# Altium schematic sheet Memory Chips 5 to 8.SchDoc
size A3
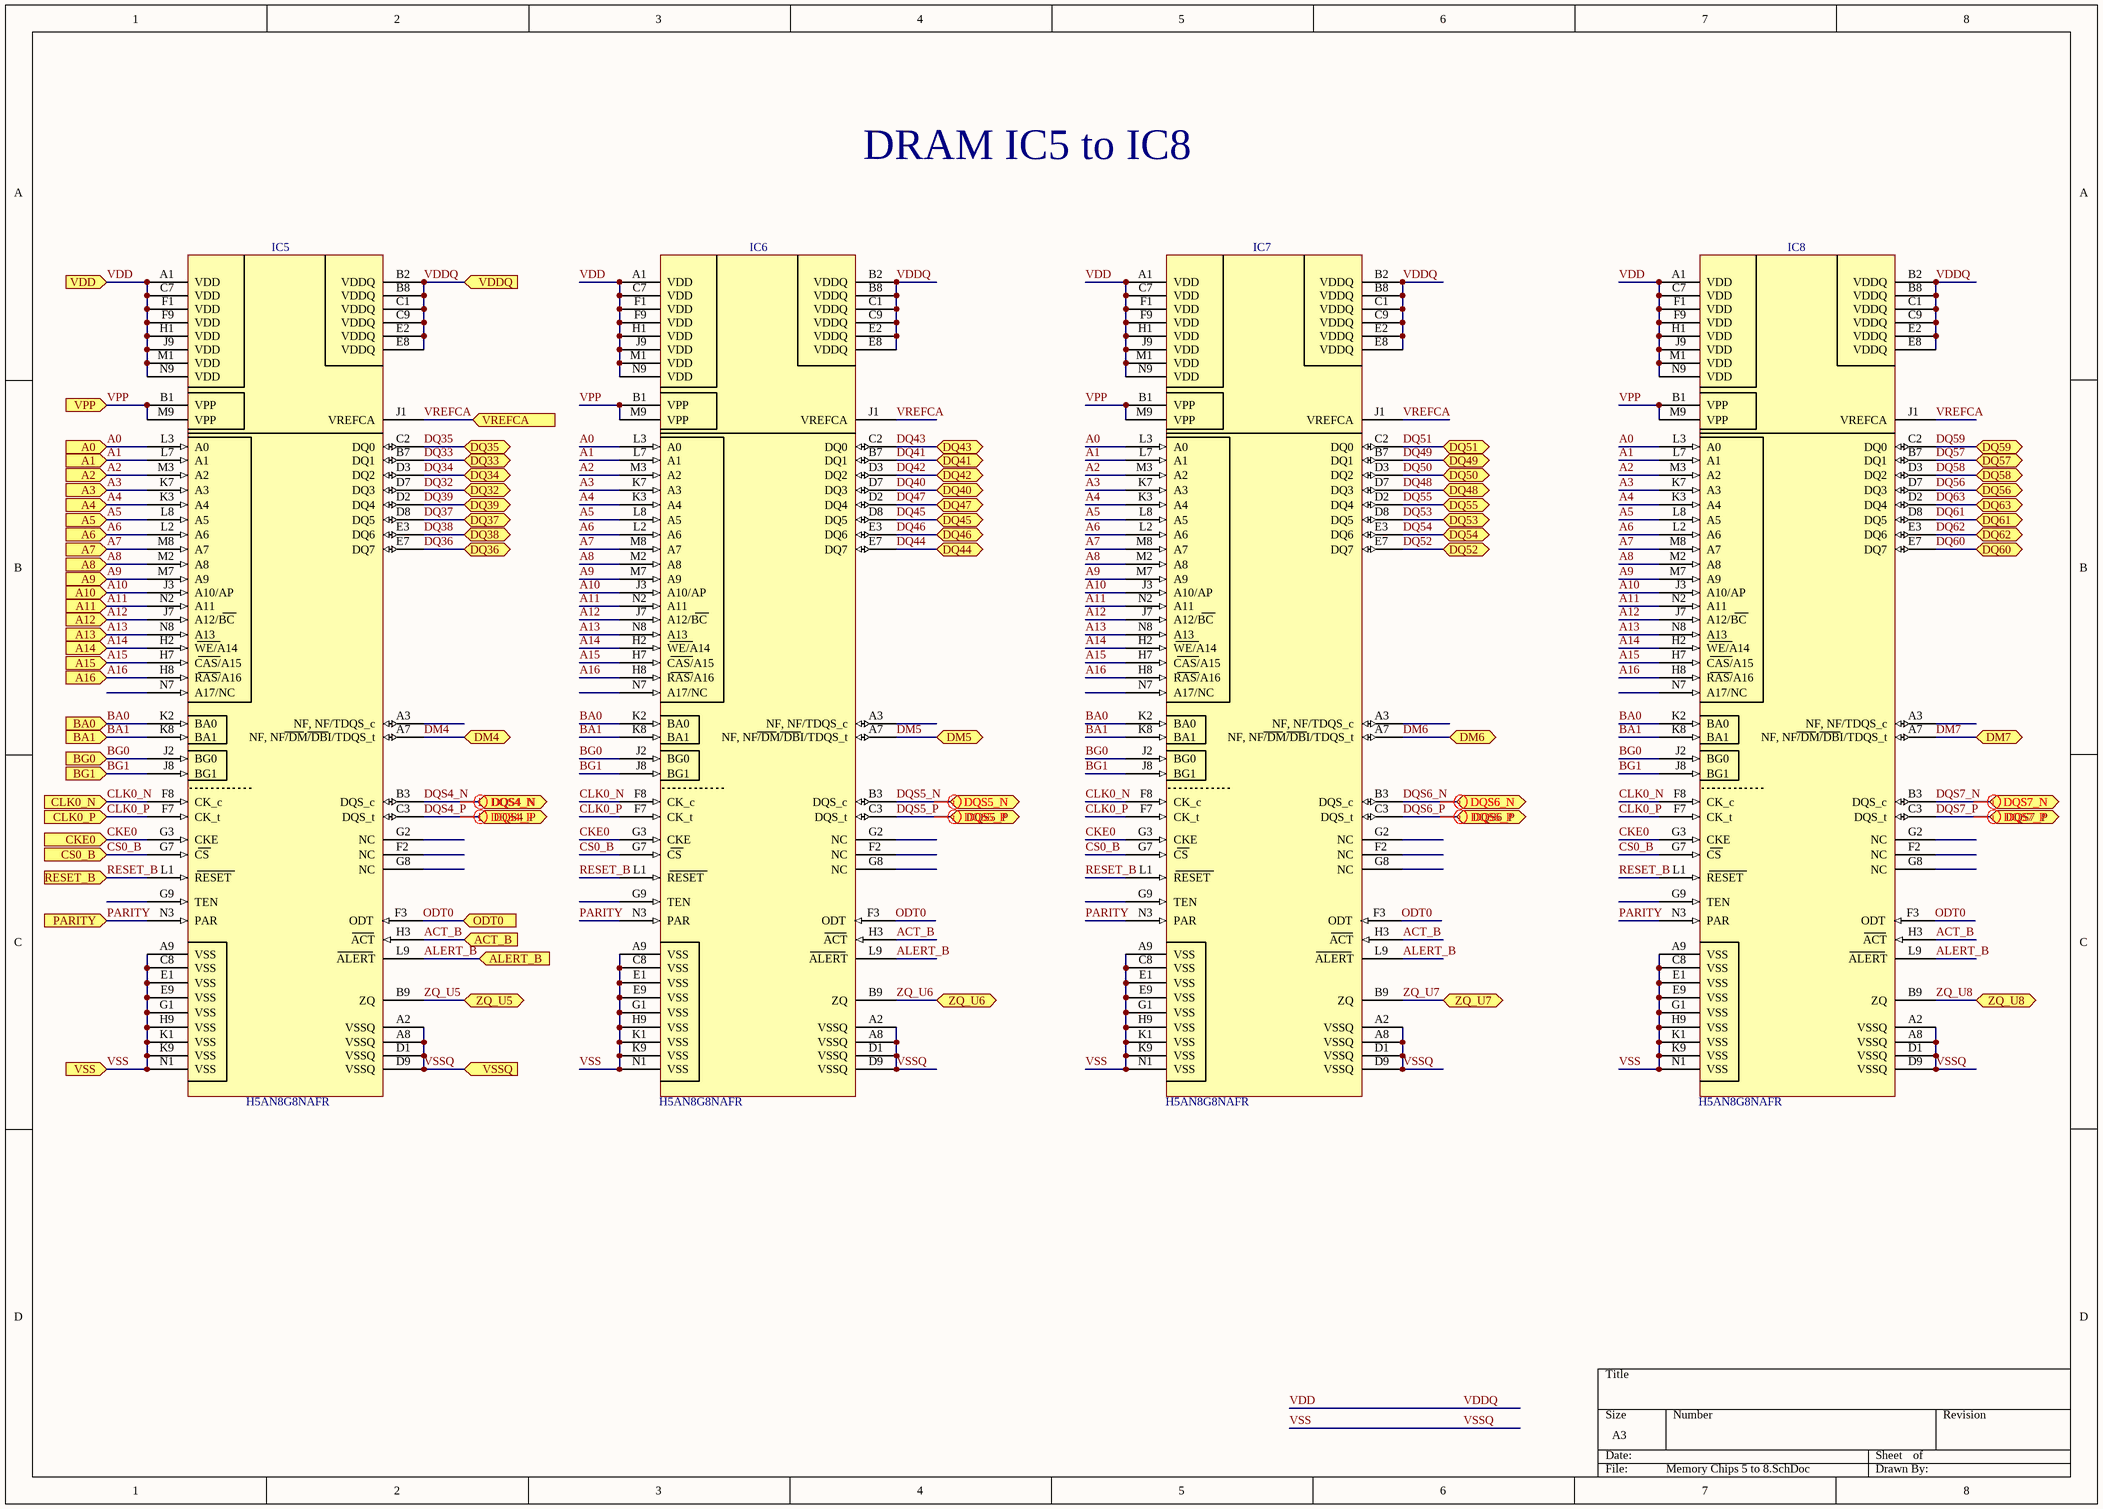
[diagram p0: Memory Chips 5 to 8.SchDoc]

## Parts
IC5  H5AN8G8NAFR  [H5AN8G8NAFR]
IC6  H5AN8G8NAFR  [H5AN8G8NAFR]
IC7  H5AN8G8NAFR  [H5AN8G8NAFR]
IC8  H5AN8G8NAFR  [H5AN8G8NAFR]

## Ports
A0 (in), A1 (in), A2 (in), A3 (in), A4 (in), A5 (in), A6 (in), A7 (in), A8 (in), A9 (in), A10 (in), A11 (in), A12 (in), A13 (in), A14 (in), A15 (in), A16 (in), ACT_B (in), ALERT_B (in), BA0 (in), BA1 (in), BG0 (in), BG1 (in), CKE0 (in), CLK0_N (in), CLK0_P (in), CS0_B (in), DM4 (bidir), DM5 (bidir), DM6 (bidir), DM7 (bidir), DQ32 (bidir), DQ33 (bidir), DQ34 (bidir), DQ35 (bidir), DQ36 (bidir), DQ37 (bidir), DQ38 (bidir), DQ39 (bidir), DQ40 (bidir), DQ41 (bidir), DQ42 (bidir), DQ43 (bidir), DQ44 (bidir), DQ45 (bidir), DQ46 (bidir), DQ47 (bidir), DQ48 (bidir), DQ49 (bidir), DQ50 (bidir), DQ51 (bidir), DQ52 (bidir), DQ53 (bidir), DQ54 (bidir), DQ55 (bidir), DQ56 (bidir), DQ57 (bidir), DQ58 (bidir), DQ59 (bidir), DQ60 (bidir), DQ61 (bidir), DQ62 (bidir), DQ63 (bidir), DQS4_N (bidir), DQS4_P (bidir), DQS5_N (bidir), DQS5_P (bidir), DQS6_N (bidir), DQS6_P (bidir), DQS7_N (bidir), DQS7_P (bidir), ODT0 (in), PARITY (in), RESET_B (in), VDD (in), VDDQ (in), VPP (in), VREFCA (in), VSS (in), VSSQ (in), ZQ_U5 (bidir), ZQ_U6 (bidir), ZQ_U7 (bidir), ZQ_U8 (bidir)

## Nets
A0: IC5.L3(A0) IC6.L3(A0) IC7.L3(A0) IC8.L3(A0) ; port A0
A1: IC5.L7(A1) IC6.L7(A1) IC7.L7(A1) IC8.L7(A1) ; port A1
A2: IC5.M3(A2) IC6.M3(A2) IC7.M3(A2) IC8.M3(A2) ; port A2
A3: IC5.K7(A3) IC6.K7(A3) IC7.K7(A3) IC8.K7(A3) ; port A3
A4: IC5.K3(A4) IC6.K3(A4) IC7.K3(A4) IC8.K3(A4) ; port A4
A5: IC5.L8(A5) IC6.L8(A5) IC7.L8(A5) IC8.L8(A5) ; port A5
A6: IC5.L2(A6) IC6.L2(A6) IC7.L2(A6) IC8.L2(A6) ; port A6
A7: IC5.M8(A7) IC6.M8(A7) IC7.M8(A7) IC8.M8(A7) ; port A7
A8: IC5.M2(A8) IC6.M2(A8) IC7.M2(A8) IC8.M2(A8) ; port A8
A9: IC5.M7(A9) IC6.M7(A9) IC7.M7(A9) IC8.M7(A9) ; port A9
A10: IC5.J3(A10/AP) IC6.J3(A10/AP) IC7.J3(A10/AP) IC8.J3(A10/AP) ; port A10
A11: IC5.N2(A11) IC6.N2(A11) IC7.N2(A11) IC8.N2(A11) ; port A11
A12: IC5.J7(A12/BC) IC6.J7(A12/BC) IC7.J7(A12/BC) IC8.J7(A12/BC) ; port A12
A13: IC5.N8(A13) IC6.N8(A13) IC7.N8(A13) IC8.N8(A13) ; port A13
A14: IC5.H2(WE/A14) IC6.H2(WE/A14) IC7.H2(WE/A14) IC8.H2(WE/A14) ; port A14
A15: IC5.H7(CAS/A15) IC6.H7(CAS/A15) IC7.H7(CAS/A15) IC8.H7(CAS/A15) ; port A15
A16: IC5.H8(RAS/A16) IC6.H8(RAS/A16) IC7.H8(RAS/A16) IC8.H8(RAS/A16) ; port A16
ACT_B: IC5.H3(ACT) IC6.H3(ACT) IC7.H3(ACT) IC8.H3(ACT) ; port ACT_B
ALERT_B: IC5.L9(ALERT) IC6.L9(ALERT) IC7.L9(ALERT) IC8.L9(ALERT) ; port ALERT_B
BA0: IC5.K2(BA0) IC6.K2(BA0) IC7.K2(BA0) IC8.K2(BA0) ; port BA0
BA1: IC5.K8(BA1) IC6.K8(BA1) IC7.K8(BA1) IC8.K8(BA1) ; port BA1
BG0: IC5.J2(BG0) IC6.J2(BG0) IC7.J2(BG0) IC8.J2(BG0) ; port BG0
BG1: IC5.J8(BG1) IC6.J8(BG1) IC7.J8(BG1) IC8.J8(BG1) ; port BG1
CKE0: IC5.G3(CKE) IC6.G3(CKE) IC7.G3(CKE) IC8.G3(CKE) ; port CKE0
CLK0_N: IC5.F8(CK_c) IC6.F8(CK_c) IC7.F8(CK_c) IC8.F8(CK_c) ; port CLK0_N
CLK0_P: IC5.F7(CK_t) IC6.F7(CK_t) IC7.F7(CK_t) IC8.F7(CK_t) ; port CLK0_P
CS0_B: IC5.G7(CS) IC6.G7(CS) IC7.G7(CS) IC8.G7(CS) ; port CS0_B
DM4: IC5.A7(NF,_NF/DM/DBI/TDQS_t) ; port DM4
DM5: IC6.A7(NF,_NF/DM/DBI/TDQS_t) ; port DM5
DM6: IC7.A7(NF,_NF/DM/DBI/TDQS_t) ; port DM6
DM7: IC8.A7(NF,_NF/DM/DBI/TDQS_t) ; port DM7
DQ32: IC5.D7(DQ3) ; port DQ32
DQ33: IC5.B7(DQ1) ; port DQ33
DQ34: IC5.D3(DQ2) ; port DQ34
DQ35: IC5.C2(DQ0) ; port DQ35
DQ36: IC5.E7(DQ7) ; port DQ36
DQ37: IC5.D8(DQ5) ; port DQ37
DQ38: IC5.E3(DQ6) ; port DQ38
DQ39: IC5.D2(DQ4) ; port DQ39
DQ40: IC6.D7(DQ3) ; port DQ40
DQ41: IC6.B7(DQ1) ; port DQ41
DQ42: IC6.D3(DQ2) ; port DQ42
DQ43: IC6.C2(DQ0) ; port DQ43
DQ44: IC6.E7(DQ7) ; port DQ44
DQ45: IC6.D8(DQ5) ; port DQ45
DQ46: IC6.E3(DQ6) ; port DQ46
DQ47: IC6.D2(DQ4) ; port DQ47
DQ48: IC7.D7(DQ3) ; port DQ48
DQ49: IC7.B7(DQ1) ; port DQ49
DQ50: IC7.D3(DQ2) ; port DQ50
DQ51: IC7.C2(DQ0) ; port DQ51
DQ52: IC7.E7(DQ7) ; port DQ52
DQ53: IC7.D8(DQ5) ; port DQ53
DQ54: IC7.E3(DQ6) ; port DQ54
DQ55: IC7.D2(DQ4) ; port DQ55
DQ56: IC8.D7(DQ3) ; port DQ56
DQ57: IC8.B7(DQ1) ; port DQ57
DQ58: IC8.D3(DQ2) ; port DQ58
DQ59: IC8.C2(DQ0) ; port DQ59
DQ60: IC8.E7(DQ7) ; port DQ60
DQ61: IC8.D8(DQ5) ; port DQ61
DQ62: IC8.E3(DQ6) ; port DQ62
DQ63: IC8.D2(DQ4) ; port DQ63
DQS4_N: IC5.B3(DQS_c) ; port DQS4_N
DQS4_P: IC5.C3(DQS_t) ; port DQS4_P
DQS5_N: IC6.B3(DQS_c) ; port DQS5_N
DQS5_P: IC6.C3(DQS_t) ; port DQS5_P
DQS6_N: IC7.B3(DQS_c) ; port DQS6_N
DQS6_P: IC7.C3(DQS_t) ; port DQS6_P
DQS7_N: IC8.B3(DQS_c) ; port DQS7_N
DQS7_P: IC8.C3(DQS_t) ; port DQS7_P
ODT0: IC5.F3(ODT) IC6.F3(ODT) IC7.F3(ODT) IC8.F3(ODT) ; port ODT0
PARITY: IC5.N3(PAR) IC6.N3(PAR) IC7.N3(PAR) IC8.N3(PAR) ; port PARITY
RESET_B: IC5.L1(RESET) IC6.L1(RESET) IC7.L1(RESET) IC8.L1(RESET) ; port RESET_B
VDD: IC5.A1(VDD) IC5.B2(VDDQ) IC5.B8(VDDQ) IC5.C1(VDDQ) IC5.C7(VDD) IC5.C9(VDDQ) IC5.E2(VDDQ) IC5.E8(VDDQ) IC5.F1(VDD) IC5.F9(VDD) IC5.H1(VDD) IC5.J9(VDD) IC5.M1(VDD) IC5.N9(VDD) IC6.A1(VDD) IC6.B2(VDDQ) IC6.B8(VDDQ) IC6.C1(VDDQ) IC6.C7(VDD) IC6.C9(VDDQ) IC6.E2(VDDQ) IC6.E8(VDDQ) IC6.F1(VDD) IC6.F9(VDD) IC6.H1(VDD) IC6.J9(VDD) IC6.M1(VDD) IC6.N9(VDD) IC7.A1(VDD) IC7.B2(VDDQ) IC7.B8(VDDQ) IC7.C1(VDDQ) IC7.C7(VDD) IC7.C9(VDDQ) IC7.E2(VDDQ) IC7.E8(VDDQ) IC7.F1(VDD) IC7.F9(VDD) IC7.H1(VDD) IC7.J9(VDD) IC7.M1(VDD) IC7.N9(VDD) IC8.A1(VDD) IC8.B2(VDDQ) IC8.B8(VDDQ) IC8.C1(VDDQ) IC8.C7(VDD) IC8.C9(VDDQ) IC8.E2(VDDQ) IC8.E8(VDDQ) IC8.F1(VDD) IC8.F9(VDD) IC8.H1(VDD) IC8.J9(VDD) IC8.M1(VDD) IC8.N9(VDD) ; port VDD, port VDDQ  [also labelled VDDQ]
VPP: IC5.B1(VPP) IC5.M9(VPP) IC6.B1(VPP) IC6.M9(VPP) IC7.B1(VPP) IC7.M9(VPP) IC8.B1(VPP) IC8.M9(VPP) ; port VPP
VREFCA: IC5.J1(VREFCA) IC6.J1(VREFCA) IC7.J1(VREFCA) IC8.J1(VREFCA) ; port VREFCA
VSS: IC5.A2(VSSQ) IC5.A8(VSSQ) IC5.A9(VSS) IC5.C8(VSS) IC5.D1(VSSQ) IC5.D9(VSSQ) IC5.E1(VSS) IC5.E9(VSS) IC5.G1(VSS) IC5.H9(VSS) IC5.K1(VSS) IC5.K9(VSS) IC5.N1(VSS) IC6.A2(VSSQ) IC6.A8(VSSQ) IC6.A9(VSS) IC6.C8(VSS) IC6.D1(VSSQ) IC6.D9(VSSQ) IC6.E1(VSS) IC6.E9(VSS) IC6.G1(VSS) IC6.H9(VSS) IC6.K1(VSS) IC6.K9(VSS) IC6.N1(VSS) IC7.A2(VSSQ) IC7.A8(VSSQ) IC7.A9(VSS) IC7.C8(VSS) IC7.D1(VSSQ) IC7.D9(VSSQ) IC7.E1(VSS) IC7.E9(VSS) IC7.G1(VSS) IC7.H9(VSS) IC7.K1(VSS) IC7.K9(VSS) IC7.N1(VSS) IC8.A2(VSSQ) IC8.A8(VSSQ) IC8.A9(VSS) IC8.C8(VSS) IC8.D1(VSSQ) IC8.D9(VSSQ) IC8.E1(VSS) IC8.E9(VSS) IC8.G1(VSS) IC8.H9(VSS) IC8.K1(VSS) IC8.K9(VSS) IC8.N1(VSS) ; port VSS, port VSSQ  [also labelled VSSQ]
ZQ_U5: IC5.B9(ZQ) ; port ZQ_U5
ZQ_U6: IC6.B9(ZQ) ; port ZQ_U6
ZQ_U7: IC7.B9(ZQ) ; port ZQ_U7
ZQ_U8: IC8.B9(ZQ) ; port ZQ_U8

Not connected (* = marked no-connect by the designer): IC5 A3(NF,_NF/TDQS_c) F2(NC) G2(NC) G8(NC) G9(TEN) N7(A17/NC); IC6 A3(NF,_NF/TDQS_c) F2(NC) G2(NC) G8(NC) G9(TEN) N7(A17/NC); IC7 A3(NF,_NF/TDQS_c) F2(NC) G2(NC) G8(NC) G9(TEN) N7(A17/NC); IC8 A3(NF,_NF/TDQS_c) F2(NC) G2(NC) G8(NC) G9(TEN) N7(A17/NC)

## Layout directives
differential pair: DQS4_N, DQS4_P, DQS5_N, DQS5_P, DQS6_N, DQS6_P, DQS7_N, DQS7_P

## Notes on the sheet
- DRAM IC5 to IC8